# Altium schematic sheet Power_Circuit.SchDoc
size A; SheetNumber: 3; SheetTotal: 6
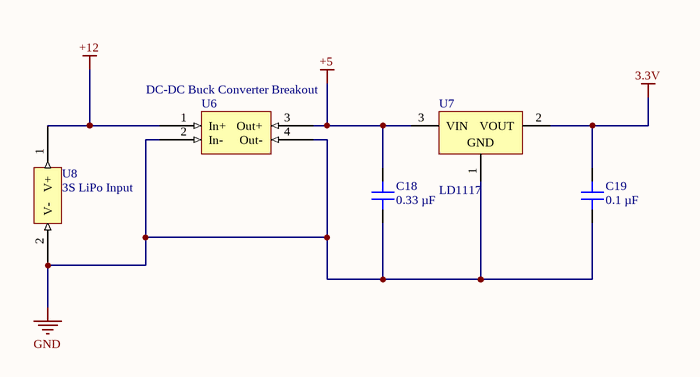
[diagram p0: Power_Circuit.SchDoc]

## Parts
C18  0.33 µF  [CAP 1210_3225 - 1MM]
C19  0.1 µF  [CAP 1210_3225 - 1MM]
U6  DC-DC Buck Converter Breakout  [DC-DC Buck Converter Breakout-Footprint-1]
U7  LD1117  [PCB - LEADED - TO - TO-220]
U8  3S LiPo Input  [3S LiPo Input-Footprint-2]

## Nets
3.3V: C19.2 U7.2(VOUT)
+5: C18.2 U6.3(Out+) U7.3(VIN)
+12: U6.1(In+) U8.1(V+)
GND: C18.1 C19.1 U6.2(In-) U6.4(Out-) U7.1(GND) U8.2(V-)

## Library data of the parts
C18 = C1210C334J3RAC7800: CAP CER 0.33UF 25V X7R 1210; manufacturer: KEMET; Tolerance: ±5%; Part Number: C1210C334J3RAC7800; Value: 0.33 µF; Applications: Bypass, Decoupling; Capacitance: 0.33 µF; componentlink1description: Datasheet; componentlink1url: https://api.kemet.com/component-edge/download/datasheet/C1210C334J3RACTU.pdf; componentlink2description: DigiKey Link; componentlink2url: https://www.digikey.com/en/products/detail/kemet/C1210C334J3RAC7800/2216802; Device Package: 1210 (3225 Metric); lastupdated: 9/19/2022 1:23:31 PM; Lifecycle Status: Active; Minimum Order: 1; Mounting Type: Surface Mount, MLCC; Operating Temperature: -55°C ~ 125°C; Package / Case: 1210 (3225 Metric); packaging: TapeAndReel; partid: 25129; Part Status: Active; price: 0.39; series: SMD Comm X7R; Size / Dimension: 0.126" L x 0.098" W (3.20mm x 2.50mm); Supplier 1: DigiKey; Supplier Part Number 1: 399-17497-1-ND; Temperature Coefficient: X7R; Thickness (Max): 0.041" (1.05mm); Voltage - Rated: 25V
C19 = C1210C104J5GACAUTO: CAP CER 0.1UF 50V C0G/NP0 1210; manufacturer: KEMET; Temperature Coefficient: C0G, NP0; Tolerance: ±5%; Part Number: C1210C104J5GACAUTO; Value: 0.1 µF; Applications: Automotive; Capacitance: 0.1 µF; componentlink1description: Datasheet; componentlink1url: https://api.kemet.com/component-edge/download/datasheet/C1210C104J5GACAUTO.pdf; componentlink2description: DigiKey Link; componentlink2url: https://www.digikey.com/en/products/detail/kemet/C1210C104J5GACAUTO/7516038; Device Package: 1210 (3225 Metric); Features: Low ESL; lastupdated: 9/19/2022 1:23:33 PM; Lifecycle Status: Active; Minimum Order: 1; Mounting Type: Surface Mount, MLCC; Operating Temperature: -55°C ~ 125°C; Package / Case: 1210 (3225 Metric); packaging: TapeAndReel; partid: 43680; Part Status: Active; price: 0.54; Ratings: AEC-Q200; series: SMD Auto C0G; Size / Dimension: 0.126" L x 0.098" W (3.20mm x 2.50mm); Supplier 1: DigiKey; Supplier Part Number 1: 399-15804-1-ND; Thickness (Max): 0.055" (1.40mm); Voltage - Rated: 50V
U6 = CMP-00001-3
U7 = 776: Linear Voltage Regulator IC  1 Output  1A TO-220AB; Rowan Part Number: 776; Manufacturer: STMicroelectronics; Manufacturer part number: LD1117AV33; Name: LD1117 - 3.3V Linear Regulator; Voltage - Output (Min or Fixed): 3.3V; Output Type: Fixed; Voltage - Input (Max): 15V; Dropout Voltage: 1.3V @ 1A; Output Configuration: Positive; Supplier 1: Digi-Key; Supplier Part Number 1: 497-1485-5-ND; Category: Linear Regulators; Datasheet: http://www.st.com/content/ccc/resource/technical/document/datasheet/a5/c3/3f/c9/2b/15/40/49/CD00002116.pdf/files/CD00002116.pdf/jcr:content/translations/en.CD00002116.pdf; Status: Active; Output Current: 1A; Voltage - Output (Max): -; Package: TO-220-3; Packaging: Tube; Type: Linear Regulator; Base Part Number: LD1117
U8 = CMP-00000-1